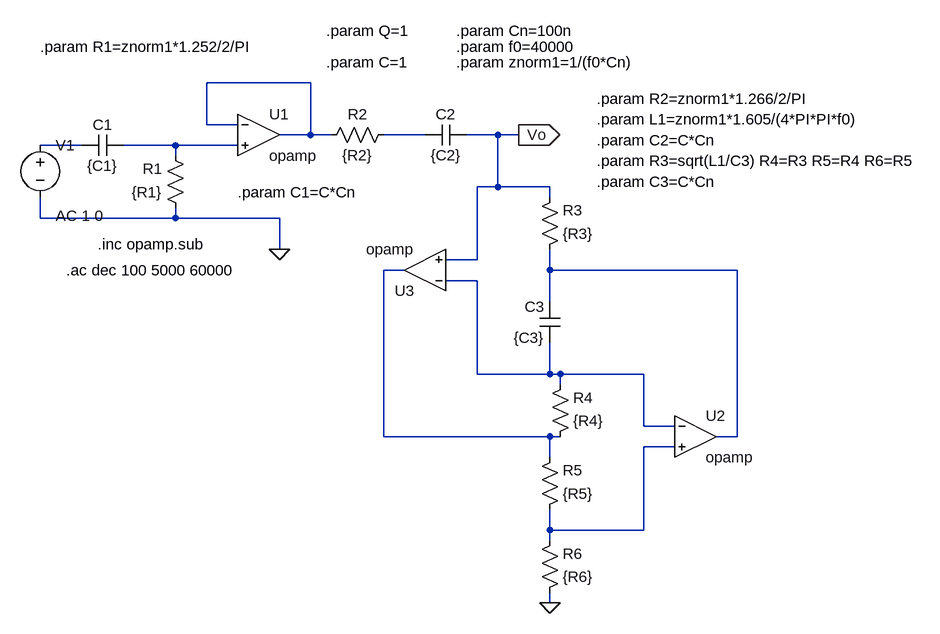
[diagram p0: schematic TS4_gic.asc]
TS4_gic.asc, the LTspice schematic file:
Version 4
SHEET 1 1488 1044
WIRE 240 32 80 32
WIRE 80 96 80 32
WIRE 128 96 80 96
WIRE 240 112 240 32
WIRE 240 112 192 112
WIRE 272 112 240 112
WIRE 416 112 352 112
WIRE 528 112 480 112
WIRE 560 112 528 112
WIRE -112 128 -176 128
WIRE 32 128 -48 128
WIRE 128 128 32 128
WIRE 32 144 32 128
WIRE 528 192 528 112
WIRE 528 192 496 192
WIRE 608 192 528 192
WIRE 608 208 608 192
WIRE -176 240 -176 208
WIRE 32 240 32 224
WIRE 32 240 -176 240
WIRE 192 240 32 240
WIRE 192 288 192 240
WIRE 496 304 496 192
WIRE 496 304 448 304
WIRE 384 320 352 320
WIRE 608 320 608 288
WIRE 896 320 608 320
WIRE 496 336 448 336
WIRE 608 368 608 320
WIRE 496 480 496 336
WIRE 608 480 608 432
WIRE 608 480 496 480
WIRE 624 480 608 480
WIRE 752 480 624 480
WIRE 624 496 624 480
WIRE 752 560 752 480
WIRE 800 560 752 560
WIRE 352 576 352 320
WIRE 608 576 352 576
WIRE 624 576 608 576
WIRE 896 576 896 320
WIRE 896 576 864 576
WIRE 800 592 752 592
WIRE 608 608 608 576
WIRE 608 720 608 688
WIRE 752 720 752 592
WIRE 752 720 608 720
WIRE 608 736 608 720
WIRE 608 832 608 816
FLAG 192 288 0
FLAG 560 112 Vo
IOPIN 560 112 Out
FLAG 608 832 0
SYMBOL res 48 240 R180
WINDOW 0 36 76 Left 2
WINDOW 3 36 40 Left 2
SYMATTR InstName R1
SYMATTR Value {R1}
SYMBOL res 368 96 R90
WINDOW 0 0 56 VBottom 2
WINDOW 3 32 56 VTop 2
SYMATTR InstName R2
SYMATTR Value {R2}
SYMBOL cap -48 112 R90
WINDOW 0 0 32 VBottom 2
WINDOW 3 32 32 VTop 2
SYMATTR InstName C1
SYMATTR Value {C1}
SYMBOL cap 416 128 R270
WINDOW 0 32 32 VTop 2
WINDOW 3 0 32 VBottom 2
SYMATTR InstName C2
SYMATTR Value {C2}
SYMBOL voltage -176 112 R0
WINDOW 123 24 124 Left 2
WINDOW 39 0 0 Left 0
SYMATTR Value2 AC 1 0
SYMATTR InstName V1
SYMATTR Value ""
SYMBOL OpAmps\\opamp 160 48 R0
SYMATTR InstName U1
SYMBOL cap 624 368 M0
SYMATTR InstName C3
SYMATTR Value {C3}
SYMBOL res 592 704 M180
WINDOW 0 36 76 Left 2
WINDOW 3 36 40 Left 2
SYMATTR InstName R5
SYMATTR Value {R5}
SYMBOL Opamps/opamp 832 512 R0
SYMATTR InstName U2
SYMBOL Opamps/opamp 416 384 R180
SYMATTR InstName U3
SYMBOL res 592 832 M180
WINDOW 0 36 76 Left 2
WINDOW 3 36 40 Left 2
SYMATTR InstName R6
SYMATTR Value {R6}
SYMBOL res 592 304 M180
WINDOW 0 36 76 Left 2
WINDOW 3 36 40 Left 2
SYMATTR InstName R3
SYMATTR Value {R3}
SYMBOL res 608 592 M180
WINDOW 0 36 76 Left 2
WINDOW 3 36 40 Left 2
SYMATTR InstName R4
SYMATTR Value {R4}
TEXT -136 320 Left 2 !.ac dec 100 5000 60000
TEXT -88 280 Left 2 !.inc opamp.sub
TEXT -176 -24 Left 2 !.param R1=znorm1*1.252/2/PI
TEXT 680 88 Left 2 !.param L1=znorm1*1.605/(4*PI*PI*f0)
TEXT 680 56 Left 2 !.param R2=znorm1*1.266/2/PI
TEXT 264 -48 Left 2 !.param Q=1
TEXT 264 0 Left 2 !.param C=1
TEXT 680 120 Left 2 !.param C2=C*Cn
TEXT 464 -48 Left 2 !.param Cn=100n
TEXT 464 -24 Left 2 !.param f0=40000
TEXT 464 0 Left 2 !.param znorm1=1/(f0*Cn)
TEXT 128 200 Left 2 !.param C1=C*Cn
TEXT 680 184 Left 2 !.param C3=C*Cn
TEXT 680 152 Left 2 !.param R3=sqrt(L1/C3) R4=R3 R5=R4 R6=R5

The netlist it stands for:
* TS4_gic.asc
R1 0 N004 {R1}
R2 N002 N001 {R2}
C1 N004 N003 {C1}
C2 N002 Vo {C2}
V1 N003 0 AC 1 0
XU1 N001 N004 N001 opamp Aol=100K GBW=10Meg  ; pins invin noninvin out
C3 N006 N007 {C3}
R5 N008 N005 {R5}
XU2 N007 N008 N006 opamp Aol=100K GBW=10Meg  ; pins invin noninvin out
XU3 N007 Vo N005 opamp Aol=100K GBW=10Meg  ; pins invin noninvin out
R6 0 N008 {R6}
R3 N006 Vo {R3}
R4 N005 N007 {R4}
.ac dec 100 5000 60000
.inc opamp.sub
.param R1=znorm1*1.252/2/PI
.param L1=znorm1*1.605/(4*PI*PI*f0)
.param R2=znorm1*1.266/2/PI
.param Q=1
.param C=1
.param C2=C*Cn
.param Cn=100n
.param f0=40000
.param znorm1=1/(f0*Cn)
.param C1=C*Cn
.param C3=C*Cn
.param R3=sqrt(L1/C3) R4=R3 R5=R4 R6=R5
.backanno
.end